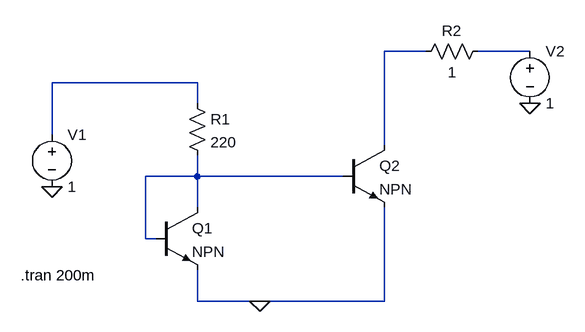
[diagram p0: schematic Current Mirror.asc]
Current Mirror.asc, the LTspice schematic file:
Version 4
SHEET 1 880 680
WIRE 448 64 384 64
WIRE 608 64 528 64
WIRE 96 112 -128 112
WIRE 96 144 96 112
WIRE -128 192 -128 112
WIRE 384 208 384 64
WIRE 96 256 96 224
WIRE 96 256 16 256
WIRE 320 256 96 256
WIRE 96 304 96 256
WIRE 16 352 16 256
WIRE 32 352 16 352
WIRE 96 448 96 400
WIRE 192 448 96 448
WIRE 384 448 384 304
WIRE 384 448 192 448
FLAG 192 448 0
FLAG -128 272 0
FLAG 608 144 0
SYMBOL npn 32 304 R0
SYMATTR InstName Q1
SYMBOL npn 320 208 R0
SYMATTR InstName Q2
SYMBOL voltage -128 176 R0
SYMATTR InstName V1
SYMATTR Value 1
SYMBOL res 80 128 R0
SYMATTR InstName R1
SYMATTR Value 220
SYMBOL voltage 608 48 R0
SYMATTR InstName V2
SYMATTR Value 1
SYMBOL res 544 48 R90
WINDOW 0 0 56 VBottom 2
WINDOW 3 32 56 VTop 2
SYMATTR InstName R2
SYMATTR Value 1
TEXT -176 408 Left 2 !.tran 200m

The netlist it stands for:
* Current Mirror.asc
Q1 N004 N004 0 0 NPN
Q2 N001 N004 0 0 NPN
V1 N003 0 1
R1 N003 N004 220
V2 N002 0 1
R2 N002 N001 1
.model NPN NPN
.model PNP PNP
.lib standard.bjt
.tran 200m
.backanno
.end